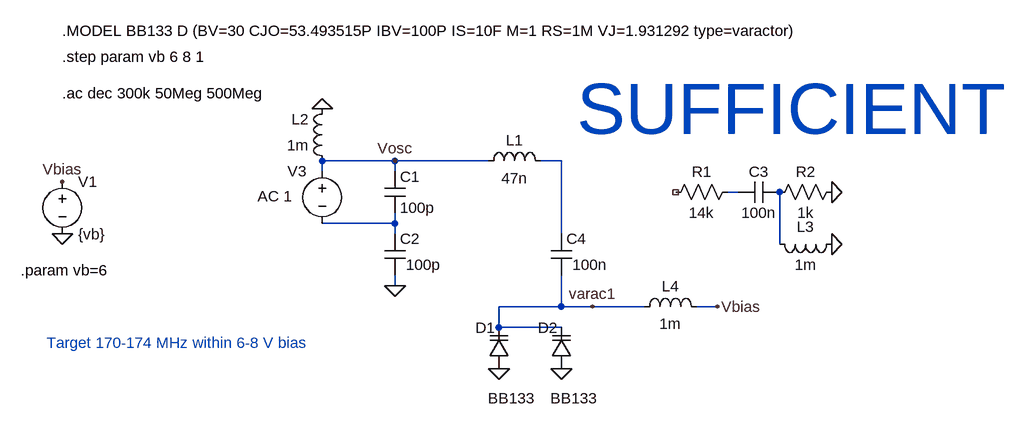
[diagram p0: schematic LO_VCO_tank_response.asc]
LO_VCO_tank_response.asc, the LTspice schematic file:
Version 4.1
SHEET 1 2860 680
WIRE 720 -96 608 -96
WIRE 864 -96 720 -96
WIRE 976 -96 944 -96
WIRE 608 -80 608 -96
WIRE 720 -80 720 -96
WIRE 1248 -48 1232 -48
WIRE 720 0 720 -16
WIRE 720 0 608 0
WIRE 720 16 720 0
WIRE 976 16 976 -96
WIRE 1312 32 1312 -48
WIRE 720 96 720 80
WIRE 976 128 976 80
WIRE 976 128 880 128
WIRE 1024 128 976 128
WIRE 1104 128 1024 128
WIRE 1216 128 1184 128
WIRE 880 160 880 128
WIRE 976 160 880 160
FLAG 208 16 0
FLAG 208 -64 Vbias
FLAG 720 -96 Vosc
FLAG 720 96 0
FLAG 1216 128 Vbias
FLAG 976 224 0
FLAG 1024 128 varac1
FLAG 608 -176 0
FLAG 1392 -48 0
FLAG 1392 32 0
FLAG 880 224 0
SYMBOL varactor 992 224 R180
WINDOW 0 21 63 Left 2
WINDOW 3 -39 -45 Left 2
SYMATTR InstName D2
SYMATTR Value BB133
SYMBOL voltage 208 -80 R0
WINDOW 123 0 0 Left 0
WINDOW 39 0 0 Left 0
WINDOW 3 24 97 Left 2
SYMATTR Value {vb}
SYMATTR InstName V1
SYMBOL cap 704 -80 R0
SYMATTR InstName C1
SYMATTR Value 100p
SYMBOL cap 704 16 R0
WINDOW 3 33 48 Left 2
SYMATTR Value 100p
SYMATTR InstName C2
SYMBOL voltage 608 -96 M0
WINDOW 123 46 54 Left 2
WINDOW 39 0 0 Left 0
SYMATTR Value2 AC 1
SYMATTR InstName V3
SYMATTR Value ""
SYMBOL ind 848 -80 R270
WINDOW 0 32 56 VTop 2
WINDOW 3 5 56 VBottom 2
SYMATTR InstName L1
SYMATTR Value 47n
SYMBOL ind 624 -80 R180
WINDOW 0 36 80 Left 2
WINDOW 3 36 40 Left 2
SYMATTR InstName L2
SYMATTR Value 1m
SYMATTR SpiceLine Rser=10
SYMBOL ind 1088 144 R270
WINDOW 0 32 56 VTop 2
WINDOW 3 5 56 VBottom 2
SYMATTR InstName L4
SYMATTR Value 1m
SYMATTR SpiceLine Rser=10
SYMBOL cap 960 16 R0
WINDOW 3 33 48 Left 2
SYMATTR Value 100n
SYMATTR InstName C4
SYMBOL res 1248 -64 R90
WINDOW 0 0 56 VBottom 2
WINDOW 3 32 56 VTop 2
SYMATTR InstName R1
SYMATTR Value 14k
SYMBOL cap 1312 -64 R90
WINDOW 0 0 32 VBottom 2
WINDOW 3 32 32 VTop 2
SYMATTR InstName C3
SYMATTR Value 100n
SYMBOL res 1408 -64 R90
WINDOW 0 0 56 VBottom 2
WINDOW 3 32 56 VTop 2
SYMATTR InstName R2
SYMATTR Value 1k
SYMBOL ind 1408 16 R90
WINDOW 0 5 56 VBottom 2
WINDOW 3 32 56 VTop 2
SYMATTR InstName L3
SYMATTR Value 1m
SYMBOL varactor 896 224 R180
WINDOW 0 21 63 Left 2
WINDOW 3 -39 -45 Left 2
SYMATTR InstName D1
SYMATTR Value BB133
TEXT 208 -256 Left 2 !.step param vb 6 8 1
TEXT 144 72 Left 2 !.param vb=6
TEXT 208 -296 Left 2 !.MODEL BB133 D (BV=30 CJO=53.493515P IBV=100P IS=10F M=1 RS=1M VJ=1.931292 type=varactor)
TEXT 208 -200 Left 2 !.ac dec 300k 50Meg 500Meg
TEXT 184 184 Left 2 ;Target 170-174 MHz within 6-8 V bias
TEXT 1000 -176 Left 7 ;SUFFICIENT

The netlist it stands for:
* LO_VCO_tank_response.asc
D2 0 varac1 BB133
V1 Vbias 0 {vb}
C1 Vosc N003 100p
C2 N003 0 100p
V3 Vosc N003 AC 1
L1 Vosc N001 47n
L2 Vosc 0 1m Rser=10
L4 varac1 Vbias 1m Rser=10
C4 N001 varac1 100n
R1 N002 NC_01 14k
C3 N004 N002 100n
R2 0 N004 1k
L3 0 N004 1m
D1 0 varac1 BB133
.model D D
.lib standard.dio
.step param vb 6 8 1
.param vb=6
.MODEL BB133 D (BV=30 CJO=53.493515P IBV=100P IS=10F M=1 RS=1M VJ=1.931292 type=varactor)
.ac dec 300k 50Meg 500Meg
* Target 170-174 MHz within 6-8 V bias
* SUFFICIENT
.backanno
.end